# EAGLE schematic OmniCar_v0.1 (EAGLE 8.6.3)
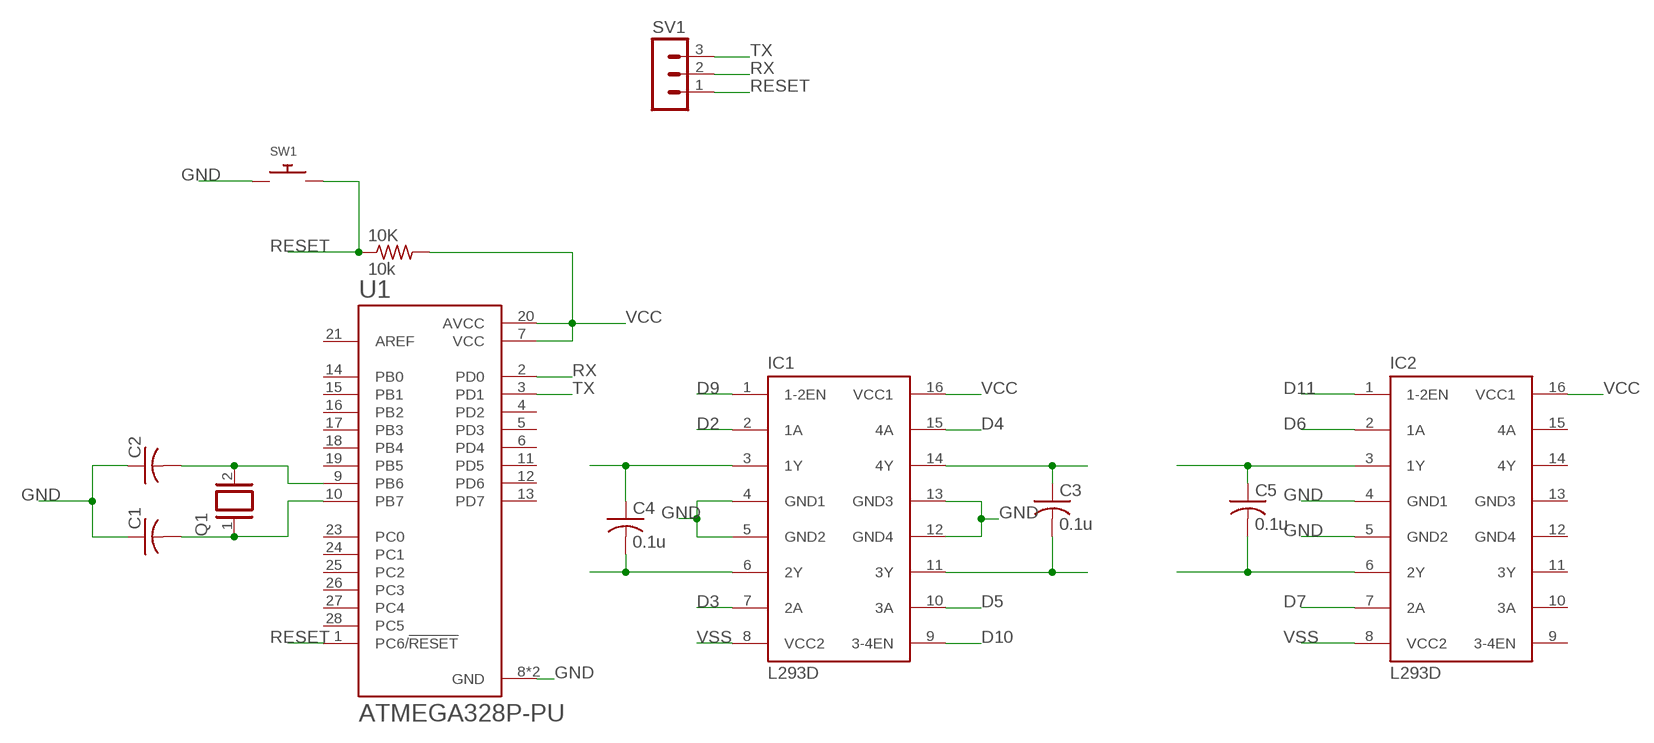
[diagram p0: schematic, sheet 1]

## Parts
10K  10k  R-US_0204/5  [0204/5]
C1  C-US025-030X050  [C025-030X050]
C2  C-US025-030X050  [C025-030X050]
C3  0.1u  C-US025-030X050  [C025-030X050]
C4  0.1u  C-US025-030X050  [C025-030X050]
C5  0.1u  C-US025-030X050  [C025-030X050]
IC1  L293D  [DIL16]
IC2  L293D  [DIL16]
Q1  XTAL  [Q]
SV1  MA03-1  [MA03-1]
SW1  SWITCH_PUSHBUTTONEVQ-PE  [TACT_PANA-EVQ]
U1  ATMEGA328P-PU  [DIP794W46P254L2967H457Q28B]

## Nets
D2: IC1.2(1A)
D3: IC1.7(2A)
D4: IC1.15(4A)
D5: IC1.10(3A)
D6: IC2.2(1A)
D7: IC2.7(2A)
D9: IC1.1(1-2EN)
D10: IC1.9(3-4EN)
D11: IC2.1(1-2EN)
GND: C1.1 C2.1 IC1.4(GND1) IC1.5(GND2) IC1.12(GND4) IC1.13(GND3) IC2.4(GND1) IC2.5(GND2) SW1.P$1 U1.8(GND) U1.22(GND)
N$1: C2.2 Q1.2 U1.9(PB6)
N$2: C1.2 Q1.1 U1.10(PB7)
N$3: C4.1 IC1.3(1Y)
N$4: C4.2 IC1.6(2Y)
N$5: C3.1 IC1.14(4Y)
N$6: C3.2 IC1.11(3Y)
N$8: C5.1 IC2.3(1Y)
N$9: C5.2 IC2.6(2Y)
RESET: 10K.1 SV1.1 SW1.P$2 U1.1(PC6/!RESET)
RX: SV1.2 U1.2(PD0)
TX: SV1.3 U1.3(PD1)
VCC: 10K.2 IC1.16(VCC1) IC2.16(VCC1) U1.7(VCC) U1.20(AVCC)
VSS: IC1.8(VCC2) IC2.8(VCC2)
Unconnected: IC2.9(3-4EN) IC2.10(3A) IC2.11(3Y) IC2.14(4Y) IC2.15(4A) U1.4(PD2) U1.5(PD3) U1.6(PD4) U1.11(PD5) U1.12(PD6) U1.13(PD7) U1.14(PB0) U1.15(PB1) U1.16(PB2) U1.17(PB3) U1.18(PB4) U1.19(PB5) U1.21(AREF) U1.23(PC0) U1.24(PC1) U1.25(PC2) U1.26(PC3) U1.27(PC4) U1.28(PC5)

## Power pins joined to a net without a drawn wire
GND3: IC2.13(GND3)
GND4: IC2.12(GND4)

## Library data of the parts
10K = adafruit:R-US_: RESISTOR, American symbol
C1-C5 = adafruit:C-US: CAPACITOR, American symbol
IC1 IC2 = L293D:L293D: PUSH-PULL 4 CHANNEL DRIVER; AVAILABILITY: Good; DESCRIPTION: Driver; 36V; Power DIP; 600mA Low LevelO/P; 1.2A O/P High Level; 4 Drivers; 7V; MF: STMicroelectronics; MP: L293D; PACKAGE: SOIC-20 STMicroelectronics; PRICE: 2.43 USD
Q1 = special:XTAL: CRYSTAL
SV1 = con-lstb:MA03-1: PIN HEADER; OC_FARNELL: unknown; OC_NEWARK: unknown
SW1 = adafruit:SWITCH_PUSHBUTTON: Buttons SOFTTOUCHSMD_SJ - Soft touch temporary push button (Super Junk Akihabara) Compatible with SKPMANE010 [Mouser: 688-SKPMAN] C&K_KSS = Digikey: KSS221GLFS
U1 = ATMEGA328P-PU:ATMEGA328P-PU: ATmega Series 20 MHz 32 KB Flash 2 KB SRAM 8-Bit Microcontroller - DIP-28; AVAILABILITY: Good; DESCRIPTION: Embedded microcontroller ATMEGA328P-PU PDIP 28 Microchip Technology 8-Bit 20 MHz I/O number 23; MF: Microchip; MP: ATMEGA328P-PU; PACKAGE: PDIP-28 Microchip; PRICE: 2.18 USD